# EAGLE design KVMeter-V2603-6.0 (EAGLE 9.6.2)
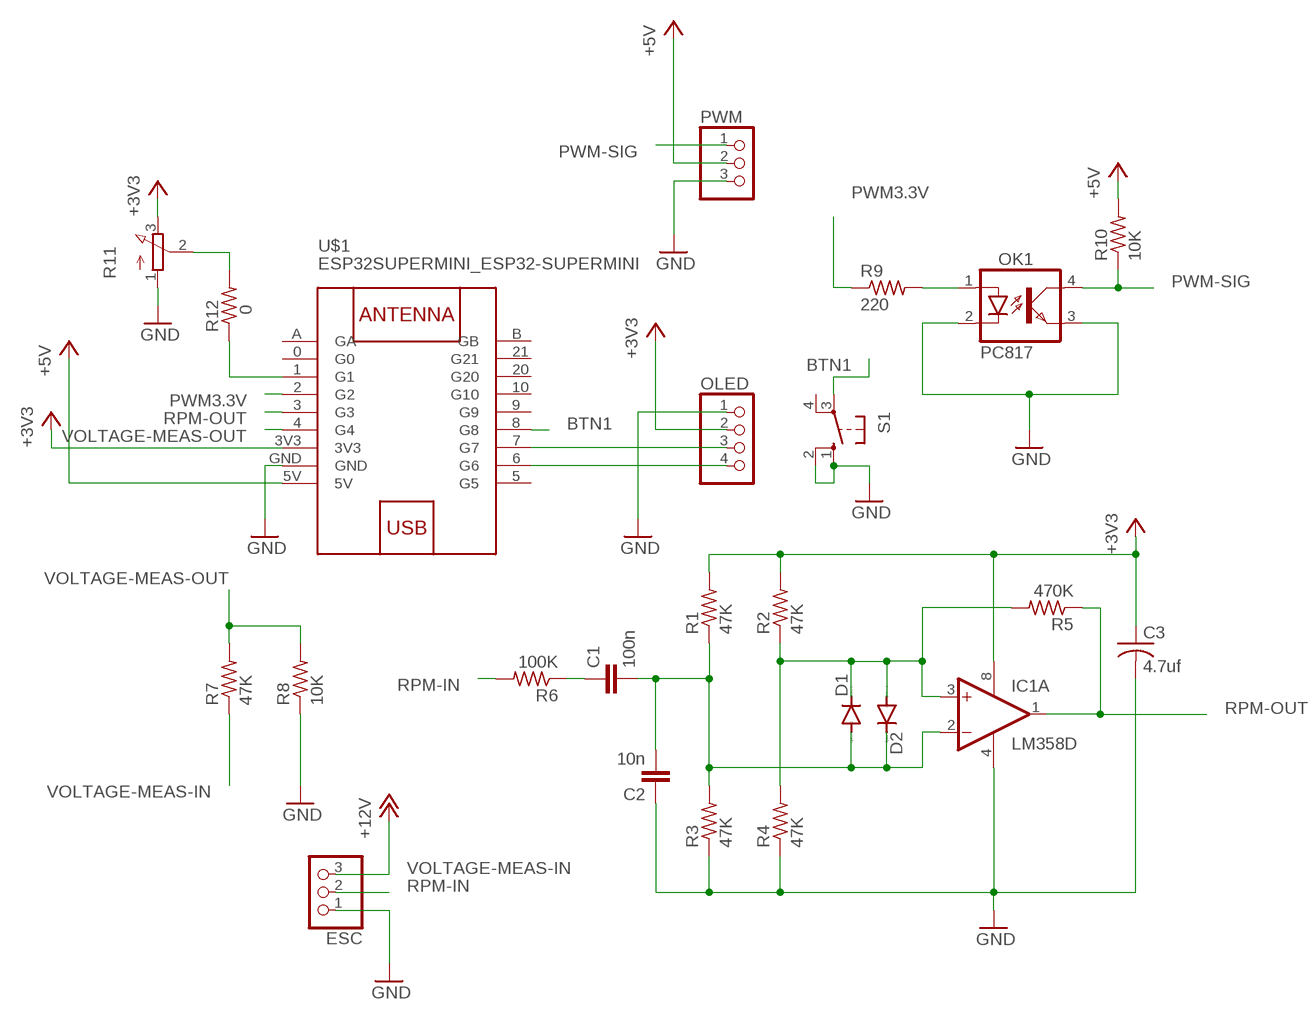
[diagram p0: schematic, sheet 1]

## Parts
C1  100n  C-EUC1206  [C1206]
C2  10n  C-EUC1206  [C1206]
C3  4.7uf  C-USC1206  [C1206]
D1  DIODE-SOD123  [SOD123]
D2  DIODE-SOD123  [SOD123]
ESC  PINHD-1X3  [1X03]
IC1  LM358D  [SO08]
OK1  PC817  [DIL04]
OLED  PINHD-1X4  [1X04]
PWM  PINHD-1X3  [1X03]
R1  47K  R-US_R1206  [R1206]
R2  47K  R-US_R1206  [R1206]
R3  47K  R-US_R1206  [R1206]
R4  47K  R-US_R1206  [R1206]
R5  470K  R-US_R1206  [R1206]
R6  100K  R-US_R1206  [R1206]
R7  47K  R-US_R1206  [R1206]
R8  10K  R-US_R1206  [R1206]
R9  220  R-US_R1206  [R1206]
R10  10K  R-US_R1206  [R1206]
R11  3RP/1610N  [3RP/1610N]
R12  0  R-US_R1206  [R1206]
S1  10-XX  [B3F-10XX]
U$1  ESP32SUPERMINI_ESP32-SUPERMINI  [ESP32SUPERMINI_ESP32-SUPERMINI]

## Nets
+3V3: C3.1 IC1.8(P:V+) OLED.2 R1.2 R2.2 R11.3(E) U$1.3V3
+5V: PWM.2 R10.2 U$1.5V
BTN1: S1.3(P) U$1.8(G8)
GND: C2.1 C3.2 ESC.1 IC1.4(P:V-) OK1.2(C) OK1.3(EMIT) OLED.1 PWM.3 R3.1 R4.1 R8.1 R11.1(A) S1.1(S) S1.2(S1) U$1.GND
N$1: D1.C D2.A IC1.3(A:+IN) R2.1 R4.2 R5.2
N$2: R11.2(S) R12.2
N$3: C1.1 R6.1
N$4: R12.1 U$1.1(G1)
N$5: OLED.4 U$1.6(G6)
N$7: C1.2 C2.2 D1.A D2.C IC1.2(A:-IN) R1.1 R3.2
N$10: OLED.3 U$1.7(G7)
N$12: OK1.1(A) R9.2
PWM3.3V: R9.1 U$1.2(G2)
PWM-SIG: OK1.4(COL) PWM.1 R10.1
RPM-IN: ESC.2 R6.2
RPM-OUT: IC1.1(A:OUT) R5.1 U$1.3(G3)
VOLTAGE-MEAS-IN: ESC.3 R7.1 ; supply symbol labelled +12V
VOLTAGE-MEAS-OUT: R7.2 R8.2 U$1.4(G4)
Unconnected: IC1.5(B:+IN) IC1.6(B:-IN) IC1.7(B:OUT) S1.4(P1) U$1.0(G0) U$1.5(G5) U$1.9(G9) U$1.10(G10) U$1.20(G20) U$1.21(G21) U$1.A(GA) U$1.B(GB)

## Library data of the parts
C1 C2 = rcl:C-EU: CAPACITOR, European symbol; SPICEPREFIX: C
C3 = rcl:C-US: CAPACITOR, American symbol; SPICEPREFIX: C
D1 D2 = diode:DIODE-: DIODE
ESC PWM = pinhead:PINHD-1X3: PIN HEADER
IC1 = linear:LM358: OP AMP also LM158; LM258; LM2904 Source: http://cache.national.com/ds/LM/LM158.pdf
OK1 = optocoupler:PC817: SHARP OPTO COUPLER; MPN: PC817X4J000F; OC_FARNELL: 9707727; OC_NEWARK: 97K7059
OLED = pinhead:PINHD-1X4: PIN HEADER
R1-R10 R12 = rcl:R-US_: RESISTOR, American symbol; SPICEPREFIX: R
R11 = pot:3RP/1610N: 16mm Potentiometer one level Source: http://www.alphapotentiometers.net/html/16mm_pot_2.html
S1 = switch-omron:10-XX: OMRON SWITCH; MPN: B3F-1000; OC_FARNELL: 176432; OC_NEWARK: 36M3542
U$1 = ESP32C3supermini:ESP32SUPERMINI_ESP32-SUPERMINI: WEMOS D1 mini: Mini Wi-Fi Board based on ESP-8266 device More details can be found here: https://www.wemos.cc/product/d1-mini.html Click here to find device on ebay.com <http://www.ebay.com/sch/wemos+d1+mini+nodemcu>

## Board
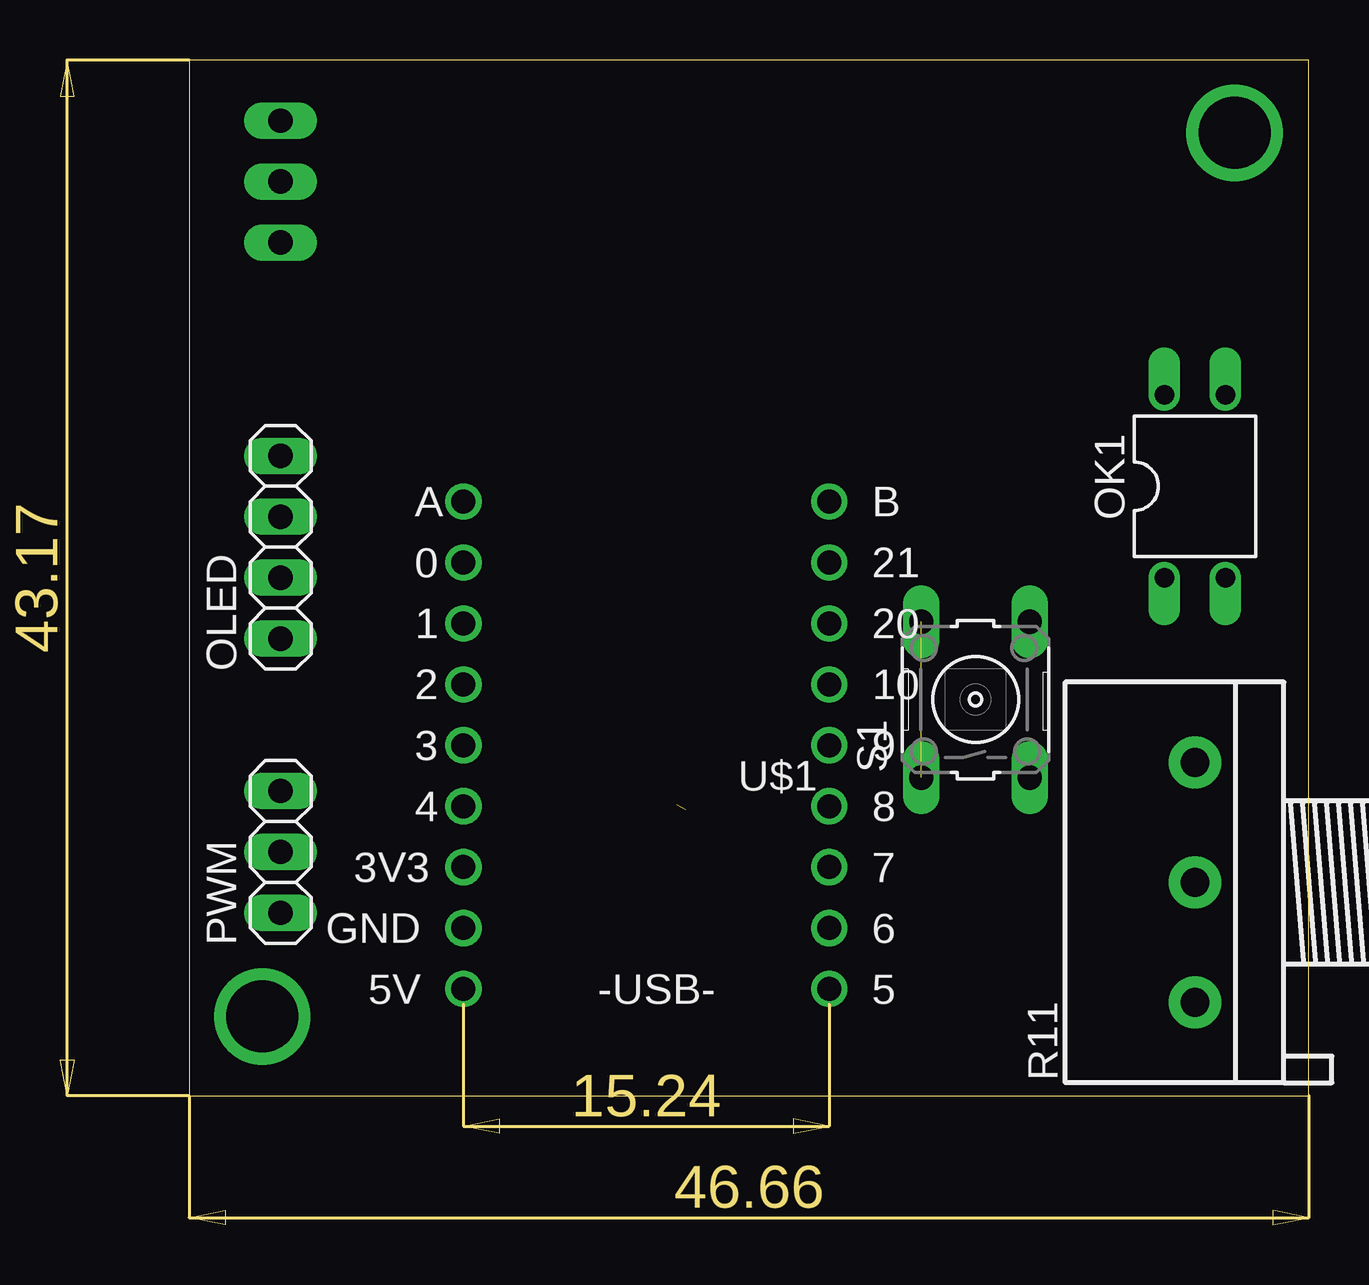
[diagram p1: board, top side]
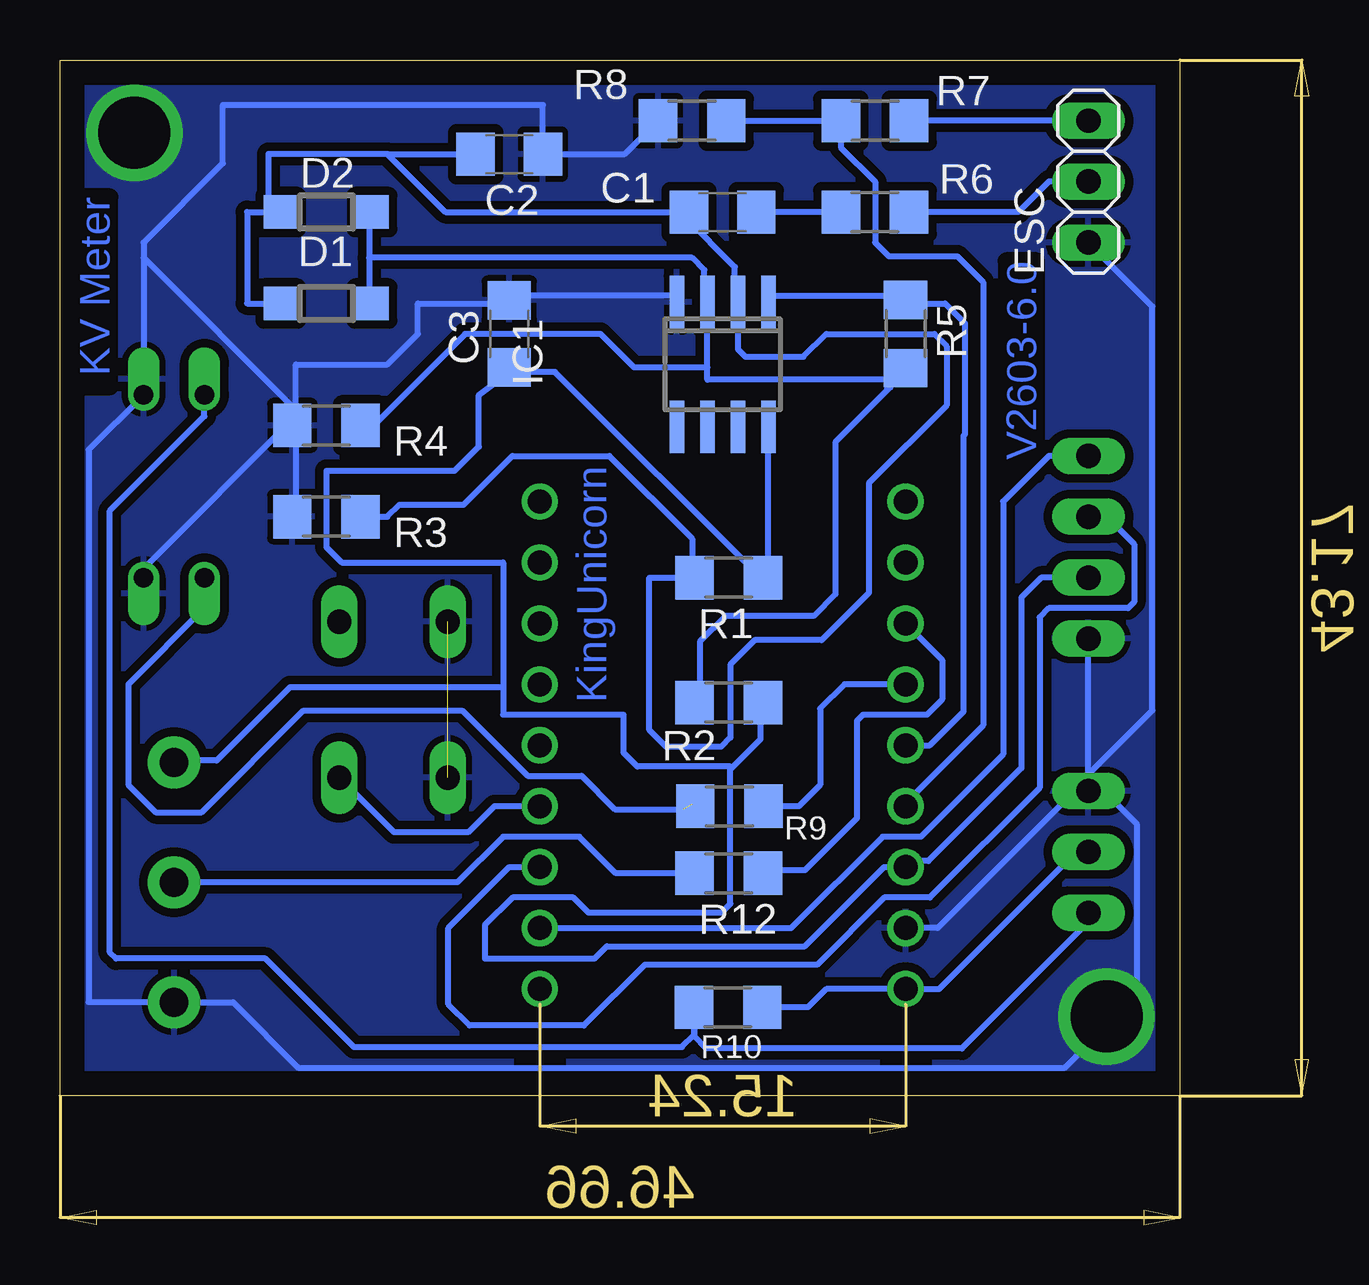
[diagram p2: board, bottom side, seen from below]

Size 46.66 x 43.17 mm. Coordinates in mm from the lower left corner, seen from the top.
Outline: 0,0 46.66,0 46.66,43.17 0,43.17 0,0
Copper layers (1*16): Top 0.035mm / dielectric 1.5mm / Bottom 0.035mm
Design rules "default *": minimum track width 10mil, minimum drill 0.6mm, track to track 10mil, track to pad 10mil, pad to pad 10mil, via to via 10mil, smd to smd 10mil, copper to edge 40mil, drill to drill 10mil, minimum pad ring 10mil, minimum via ring 8mil, stop-mask expansion 4mil, vias tented up to drill 0mil, thermal gap 10mil

### Footprints (pad centres in the part's own frame; a part is rotated, then mirrored left to right if it is on the bottom)
C1206 = smd 1.6 x 1.8: 1 -1.4,0; 2 1.4,0
SOD123 = smd 1.4 x 1.4: A 1.9,0; C -1.9,0
1X03 = drill 1.016 long: 1 -2.54,0; 2 0,0; 3 2.54,0
SO08 = smd 0.6 x 2.2: 1 -1.905,-2.6; 2 -0.635,-2.6; 3 0.635,-2.6; 4 1.905,-2.6; 5 1.905,2.6; 6 0.635,2.6; 7 -0.635,2.6; 8 -1.905,2.6
DIL04 = drill 0.813 offset: 1 -1.27,-3.81; 2 1.27,-3.81; 3 1.27,3.81; 4 -1.27,3.81
1X04 = drill 1.016 long: 1 -3.81,0; 2 -1.27,0; 3 1.27,0; 4 3.81,0
R1206 = smd 1.6 x 1.803: 1 -1.422,0; 2 1.422,0
3RP/1610N = drill 1.2 pad 2.184: 1 -5,0; 2 0,0; 3 5,0
B3F-10XX = drill 1.016 long: 1 -3.251,2.261; 2 3.251,2.261; 3 -3.251,-2.261; 4 3.251,-2.261
ESP32SUPERMINI_ESP32-SUPERMINI = drill 1: 0 -11.43,9.525; 1 -11.43,6.985; 2 -11.43,4.445; 3 -11.43,1.905; 3V3 -11.43,-3.175; 4 -11.43,-0.635; 5 3.81,-8.255; 5V -11.43,-8.255; 6 3.81,-5.715; 7 3.81,-3.175; 8 3.81,-0.635; 9 3.81,1.905; 10 3.81,4.445; 20 3.81,6.985; 21 3.81,9.525; A -11.43,12.065; B 3.81,12.065; GND -11.43,-5.715

### Placement (x,y rotation side)
C1  19.05,36.83 180 bottom
C2  27.94,39.24 180 bottom
C3  27.94,31.75 90 bottom
D1  35.56,33.02 180 bottom
D2  35.56,36.83 0 bottom
ESC  3.81,38.1 90 bottom
IC1  19.05,30.48 180 bottom
OK1  41.91,25.4 0 top
OLED  3.81,22.86 90 top
PWM  3.81,10.16 90 top
R1  18.8,21.59 0 bottom
R2  18.8,16.38 0 bottom
R3  35.56,24.13 0 bottom
R4  35.56,27.94 0 bottom
R5  11.43,31.75 270 bottom
R6  12.7,36.83 0 bottom
R7  12.7,40.64 180 bottom
R8  20.32,40.64 0 bottom
R9  18.77,12.06 180 bottom
R10  18.82,3.68 0 bottom
R11  41.91,8.89 90 top
R12  18.8,9.27 180 bottom
S1  32.77,16.51 90 top
U$1  22.86,12.7 0 top

### Tracks (layer width: path | path; a pad name or v marks a point on that pad's centre or on a via)
+3V3
  Bottom 0.254: OLED.2 5.78,21.59 6.6,20.77 6.6,13.65 10.48,9.78 11.18,9.78 U$1.3V3 12.32,9.53 15.62,6.22 23.88,6.22 24.38,5.71 28.96,5.71 28.96,7.11 27.8,8.26 25.27,8.26 24.64,7.62 19.11,7.62 18.73,8 18.73,13.59 | 27.94,30.16 26.04,30.16 17.46,21.59 R1.2 17.14,21.59 IC1.8 | 18.73,13.59 17.46,14.86 17.46,16.19 R2.2 | 18.73,13.59 18.73,13.72 22.61,13.72 23.18,14.29 23.18,15.88 28.19,15.88 28.19,17.02 | 41.91,13.65 R11.3 41.91,13.97 40.13,13.97 37.08,17.02 28.19,17.02 | 27.94,30.16 29.21,29.21 29.21,27.05 30.23,26.04 35.56,26.04 35.56,22.86 34.92,22.23 28.19,22.23 28.19,17.02 | 27.94,30.16 C3.1
+5V
  Bottom 0.254: R10.2 15.49,3.68 14.73,4.45 U$1.5V 10.03,4.45 4.32,10.16 PWM.2
BTN1
  Bottom 0.254: U$1.8 28.56,12.06 29.65,10.97 32.74,10.97 S1.3
GND  (via drill 3)  (1 unrouted)
  Bottom 0.254: U$1.GND 10.1,6.99 4.38,12.7 PWM.3 | PWM.3 3.81,13.4 | 3.81,13.4 OLED.1 | ESC.1 1.14,32.89 1.14,16.07 3.81,13.4 | IC1.4 20.95,33.34 27.94,33.34 C3.2 27.94,33.02 31.75,33.02 31.75,31.75 33.02,30.48 36.83,30.48 36.83,28.32 | 36.83,27.94 36.83,24.13 R3.1 | 36.83,28.09 36.83,28.32 | 21.59,40.64 R8.1 23.14,39.24 C2.1 26.54,41.29 39.88,41.29 39.88,38.86 43.18,35.56 43.18,34.92 | PWM.3 3.17,12.7 1.78,11.3 1.78,4.19 4.83,1.14 36.7,1.14 39.45,3.89 R11.1 45.47,3.89 45.47,26.92 OK1.3 43.18,34.92 | OK1.2 43.18,21.97 36.83,28.32 | 36.83,27.94 R4.1 | 36.83,27.94 36.83,28.57 43.18,34.92
  other vias: 43.56,40.13 3.05,3.3
  pour Bottom (isolate 0.356): 0,0 0,43.18 46.99,43.18 46.99,0
N$1
  Bottom 0.254: D1.C 33.78,33.02 33.78,34.92 | 12.06,29.53 12.16,29.43 | 12.16,29.43 14.35,27.24 14.35,20.89 15.24,20 18.92,20 20,18.92 20,16.51 R2.1 | R4.2 33.59,27.94 29.78,31.75 24.13,31.75 22.73,30.35 19.68,30.35 | 19.68,30.35 19.68,29.84 11.75,29.84 11.43,30.16 R5.2 11.68,29.97 12.19,29.46 12.16,29.43 | 19.68,30.35 IC1.3 19.81,33.27 19.81,34.42 20.32,34.92 33.78,34.92 | 33.78,34.92 33.78,36.83 D2.A
N$2
  Bottom 0.254: R11.2 30.1,8.89 28.19,10.79 25.02,10.79 23.5,9.27 R12.2
N$3
  Bottom 0.254: R6.1 C1.1
N$4
  Bottom 0.254: U$1.1 9.91,18.16 9.91,16.51 10.54,15.88 13.21,15.88 13.46,15.62 13.46,11.56 15.62,9.4 17.25,9.4 R12.1
N$5
  Bottom 0.254: U$1.6 16.19,6.99 12.38,10.79 10.79,10.79 7.37,14.22 7.37,24.77 5.46,26.67 OLED.4
N$7
  Bottom 0.254: 20.32,21.59 22.1,21.59 22.1,15.24 21.4,14.54 19.11,14.54 18.73,14.92 18.73,17.97 17.72,18.99 14.92,18.99 12.95,20.95 12.95,25.53 9.72,28.77 9.72,31.24 10.22,31.75 14.73,31.75 15.68,30.8 18.1,30.8 18.41,31.11 IC1.2 18.54,33.27 18.54,34.54 20.64,36.64 20.32,36.96 C1.2 30.61,36.83 33.02,39.24 | 20.32,21.59 R1.1 | D1.A 38.86,33.02 38.86,36.83 D2.C 37.97,36.83 37.97,39.24 33.02,39.24 | 33.02,39.24 C2.2 | R3.2 33.02,24.13 32.51,24.64 29.84,24.64 27.81,26.67 23.77,26.67 20.32,23.22 20.32,21.59
N$10
  Bottom 0.254: OLED.3 3.05,24.13 1.91,22.99 1.91,20.57 2.16,20.32 5.46,20.32 5.84,19.94 5.84,12.83 10.41,8.26 12.32,8.26 15.11,5.46 22.29,5.46 24.83,2.92 29.59,2.92 30.48,3.81 30.48,6.99 27.94,9.53 U$1.7
N$12  (1 unrouted)
  Bottom 0.254: 20.32,12.13 R9.2 | OK1.1 40.64,20.32 43.81,17.14 43.81,12.95 42.67,11.81 40.76,11.81 36.52,16.05 29.91,16.05 27.18,13.33 24.93,13.33 23.54,11.94 20.7,11.94
PWM3.3V
  Bottom 0.254: U$1.2 13.97,17.14 14.99,16.13 14.99,12.95 15.88,12.06 R9.1
PWM-SIG
  Bottom 0.254: PWM.1 3.81,7.24 9.08,1.97 19.75,1.97 20.24,2.46 R10.1 | 20.32,3.62 R10.1 | OK1.4 40.64,28.32 44.58,24.38 44.58,5.97 44.32,5.71 38.1,5.71 34.42,2.03 20.75,2.03 20.24,2.54 R10.1
RPM-IN
  Bottom 0.254: R6.2 6.73,36.83 5.46,38.1 ESC.2
RPM-OUT
  Bottom 0.254: IC1.1 17.14,33.34 11.43,33.34 R5.1 11.43,33.02 9.78,33.02 8.95,32.19 8.95,27.56 9.02,27.5 9.02,16 10.41,14.61 U$1.3
VOLTAGE-MEAS-IN
  Bottom 0.254: ESC.3 R7.1
VOLTAGE-MEAS-OUT
  Bottom 0.254: U$1.4 11.43,12.19 8.19,15.43 8.19,33.91 9.27,34.99 12.13,34.99 12.7,35.56 12.7,38.1 14.12,39.52 R7.2 R8.2

### Text on the board
Bottom: KV Meter | V2603-6.0 | KingUnicorn